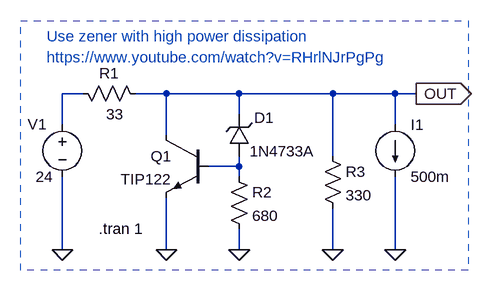
[diagram p0: schematic Draft1.asc]
Draft1.asc, the LTspice schematic file:
Version 4
SHEET 1 1260 680
WIRE 16 -352 -16 -352
WIRE 144 -352 96 -352
WIRE 256 -352 144 -352
WIRE 400 -352 256 -352
WIRE 496 -352 400 -352
WIRE 528 -352 496 -352
WIRE 256 -320 256 -352
WIRE -16 -304 -16 -352
WIRE 496 -304 496 -352
WIRE 144 -288 144 -352
WIRE 400 -256 400 -352
WIRE 256 -240 256 -256
WIRE 256 -240 208 -240
WIRE 256 -224 256 -240
WIRE -16 -112 -16 -224
WIRE 144 -112 144 -192
WIRE 256 -112 256 -144
WIRE 400 -112 400 -176
WIRE 496 -112 496 -224
FLAG 496 -112 0
FLAG 256 -112 0
FLAG -16 -112 0
FLAG 528 -352 OUT
IOPIN 528 -352 Out
FLAG 144 -112 0
FLAG 400 -112 0
SYMBOL voltage -16 -320 R0
WINDOW 0 -53 15 Left 2
WINDOW 123 0 0 Left 0
WINDOW 39 0 0 Left 0
WINDOW 3 -41 96 Left 2
SYMATTR InstName V1
SYMATTR Value 24
SYMBOL res 0 -368 M90
WINDOW 0 0 56 VBottom 2
WINDOW 3 32 65 VTop 2
SYMATTR InstName R1
SYMATTR Value 33
SYMBOL zener 272 -256 R180
WINDOW 0 -38 59 Left 2
WINDOW 3 -101 7 Left 2
SYMATTR InstName D1
SYMATTR Value 1N4733A
SYMBOL current 496 -304 R0
WINDOW 123 0 0 Left 0
WINDOW 39 0 0 Left 0
SYMATTR InstName I1
SYMATTR Value 500m
SYMBOL npn 208 -288 M0
SYMATTR InstName Q1
SYMATTR Value TIP122
SYMBOL res 240 -240 R0
SYMATTR InstName R2
SYMATTR Value 680
SYMBOL res 384 -272 R0
SYMATTR InstName R3
SYMATTR Value 330
TEXT 40 -144 Left 2 !.tran 1
TEXT -40 -408 Left 2 ;https://www.youtube.com/watch?v=RHrlNJrPgPg
TEXT -40 -440 Left 2 ;Use zener with high power dissipation
RECTANGLE Normal 608 -80 -80 -464 2

The netlist it stands for:
* Draft1.asc
V1 N001 0 24
R1 N001 OUT 33
D1 N002 OUT 1N4733A
I1 OUT 0 500m
Q1 OUT N002 0 0 TIP122
R2 N002 0 680
R3 OUT 0 330
.model D D
.lib standard.dio
.model NPN NPN
.model PNP PNP
.lib standard.bjt
.tran 1
* https://www.youtube.com/watch?v=RHrlNJrPgPg
* Use zener with high power dissipation
.backanno
.end